# Altium schematic sheet ch.SchDoc
size 406 x 241 mm
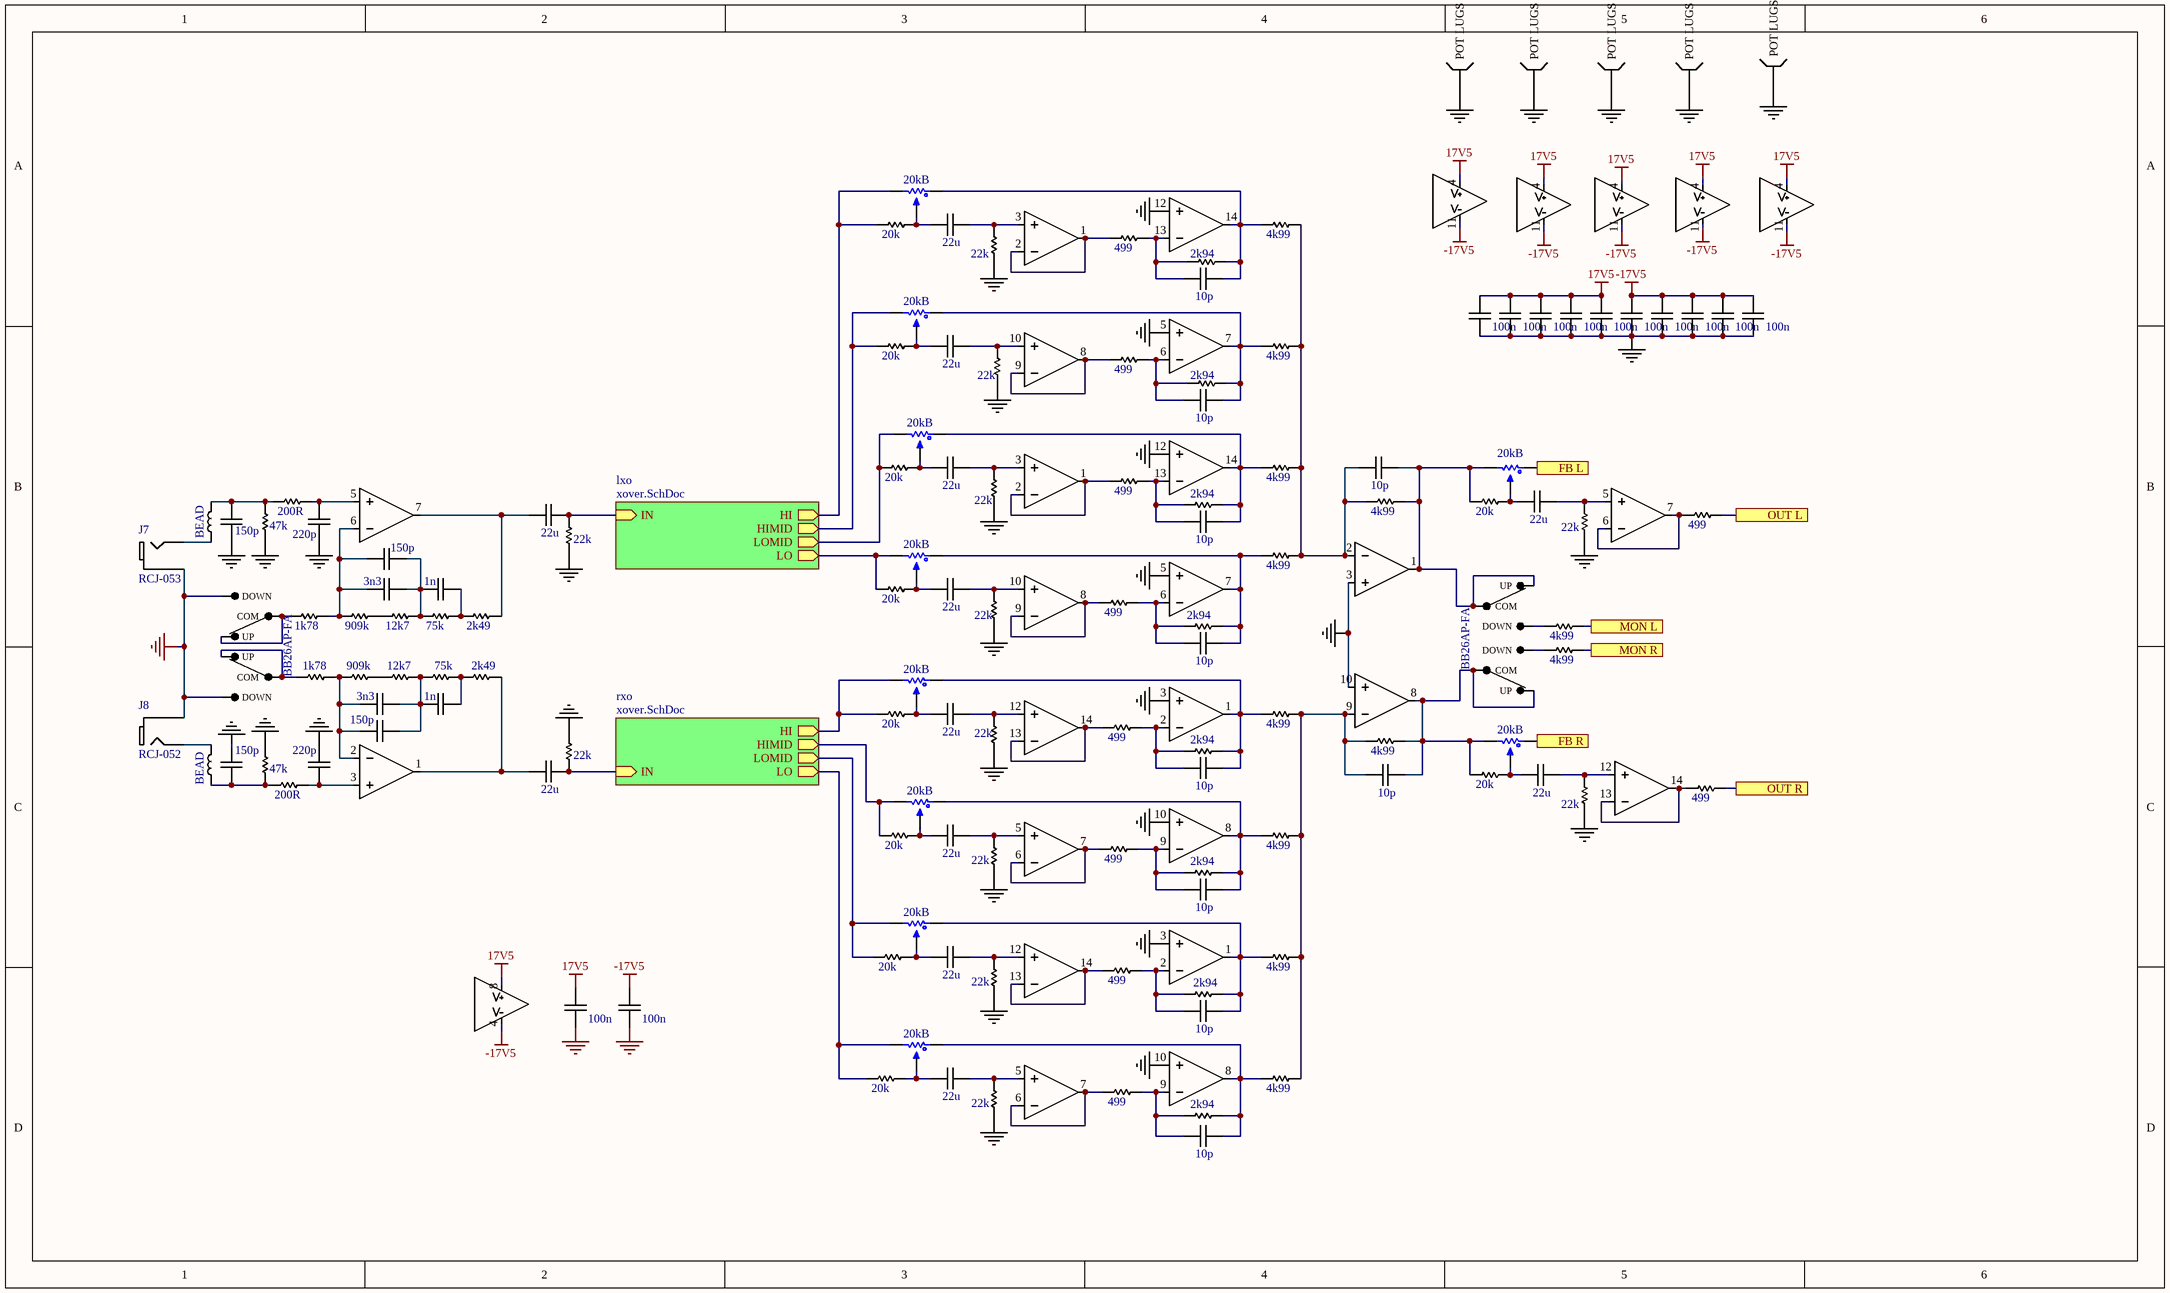
[diagram p0: ch.SchDoc]

## Parts
C1  22u  [0805]
C2  10p  [0805]
C3  100n  [0805]
C4  100n  [0805]
C6  100n  [0805]
C8  100n  [0805]
C9  100n  [0805]
C10  22u  [0805]
C11  10p  [0805]
C12  100n  [0805]
C13  22u  [0805]
C14  22u  [0805]
C16  10p  [0805]
C18  22u  [0805]
C19  10p  [0805]
C20  22u  [0805]
C21  10p  [0805]
C22  22u  [0805]
C25  22u  [0805]
C27  10p  [0805]
C28  10p  [0805]
C29  22u  [0805]
C32  10p  [0805]
C34  22u  [0805]
C35  10p  [0805]
C42  10p  [0805]
C63  220p  [0805]
C64  150p  [0805]
C65  22u  [0805]
C67  150p  [0805]
C68  3n3  [0805]
C69  1n  [0805]
C71  100n  [0805]
C72  100n  [0805]
C74  3n3  [0805]
C75  1n  [0805]
C76  150p  [0805]
C78  150p  [0805]
C79  22u  [0805]
C80  220p  [0805]
C203  100n  [0805]
C208  100n  [0805]
C210  100n  [0805]
C215  100n  [0805]
J7  RCJ-053  [RCJ-053]
J8  RCJ-052  [RCJ-052]
L1  BEAD  [0805]
L2  BEAD  [0805]
R1  20kB  [P0925N-FC15AR10K]  (parts A,B,C of 3)
R2  499  [0805]
R3  22k  [0805]
R4  2k94  [0805]
R8  499  [0805]
R9  22k  [0805]
R10  2k94  [0805]
R11  499  [0805]
R12  22k  [0805]
R14  4k99  [0805]
R15  499  [0805]
R16  20k  [0805]
R17  2k94  [0805]
R18  20k  [0805]
R19  22k  [0805]
R20  4k99  [0805]
R21  4k99  [0805]
R22  499  [0805]
R23  22k  [0805]
R24  2k94  [0805]
R25  20k  [0805]
R28  499  [0805]
R33  22k  [0805]
R34  2k94  [0805]
R35  20k  [0805]
R36  499  [0805]
R37  22k  [0805]
R38  499  [0805]
R39  22k  [0805]
R40  2k94  [0805]
R41  499  [0805]
R42  22k  [0805]
R43  2k94  [0805]
R44  499  [0805]
R45  22k  [0805]
R46  2k94  [0805]
R52  20k  [0805]
R53  200R  [0805]
R54  22k  [0805]
R55  47k  [0805]
R56  20k  [0805]
R57  909k  [0805]
R58  12k7  [0805]
R59  2k49  [0805]
R60  20k  [0805]
R61  20k  [0805]
R62  1k78  [0805]
R63  75k  [0805]
R64  20k  [0805]
R65  20k  [0805]
R66  909k  [0805]
R67  12k7  [0805]
R68  1k78  [0805]
R69  75k  [0805]
R70  2k49  [0805]
R72  47k  [0805]
R73  22k  [0805]
R74  200R  [0805]
R75  4k99  [0805]
R76  4k99  [0805]
R148  20kB  [P0925N-FC15AR10K]  (parts A,B,C of 3)
R149  20kB  [P0925N-FC15AR10K]  (parts A,B,C of 3)
R150  20kB  [P0925N-FC15AR10K]  (parts A,B,C of 3)
R151  20kB  [P0925N-FC15AR10K]  (parts A,B,C of 3)
R173  4k99  [0805]
R177  4k99  [0805]
R184  4k99  [0805]
R187  4k99  [0805]
R200  4k99  [0805]
R201  4k99  [0805]
R207  4k99  [0805]
SW1  BB26AP-FA  [BB26AP-FA]  (parts A,B of 2)
SW5  BB26AP-FA  [BB26AP-FA]  (value not drawn)  (parts A,B of 2)
U1  OPA16X4  [SOIC127P600X175-14M]  (value not drawn)  (parts A,B,C,D,E of 5)
U2  OPA16X4  [SOIC127P600X175-14M]  (value not drawn)  (parts A,B,C,D,E of 5)
U3  OPA16X4  [SOIC127P600X175-14M]  (value not drawn)  (parts A,B,C,D,E of 5)
U4  OPA16X4  [SOIC127P600X175-14M]  (value not drawn)  (parts A,B,C,D,E of 5)
U5  OPA16X4  [SOIC127P600X175-14M]  (value not drawn)  (parts A,B,C,D,E of 5)
U20  OPA16X2  [SOIC127P600X175-8M]  (value not drawn)  (parts A,B,C of 3)

## Sub-sheets
lxo = xover.SchDoc: IN (in), HI (out), HIMID (out), LOMID (out), LO (out)
rxo = xover.SchDoc: IN (in), HI (out), HIMID (out), LOMID (out), LO (out)

## Ports
FB L, FB R, MON L, MON R, OUT L, OUT R

## Nets
17V5: C3.1 C4.1 C9.1 C71.1 C203.1 C208.1 U1.4(V+) U2.4(V+) U3.4(V+) U4.4(V+) U5.4(V+) U20.8(V+)
-17V5: C6.1 C8.1 C12.1 C72.1 C210.1 C215.1 U1.11(V-) U2.11(V-) U3.11(V-) U4.11(V-) U5.11(V-) U20.4(V-)
GND: C3.2 C4.2 C6.2 C8.2 C9.2 C12.2 C63.1 C64.1 C71.2 C72.2 C78.2 C80.2 C203.2 C208.2 C210.2 C215.2 J7.1 J8.1 R1.7(POT_LUGS) R3.1 R9.1 R12.1 R19.1 R23.1 R33.1 R37.1 R39.1 R42.1 R45.1 R54.2 R55.1 R72.2 R73.1 R148.7(POT_LUGS) R149.7(POT_LUGS) R150.7(POT_LUGS) R151.7(POT_LUGS) SW5.1(DOWN) SW5.4(DOWN) U1.5(IN_B+) U1.12(IN_D+) U2.5(IN_B+) U2.12(IN_D+) U3.3(+IN_A) U3.10(IN_C+) U4.3(+IN_A) U4.10(IN_C+) U5.3(+IN_A) U5.10(IN_C+)
FB L: R1.1 ; port FB L
FB R: R1.4 ; port FB R
MON L: R75.2 ; port MON L
MON R: R76.2 ; port MON R
OUT L: R15.2 ; port OUT L
OUT R: R36.2 ; port OUT R
NetC1_1: C1.1 R16.1 R148.2
NetC1_2: C1.2 R3.2 U1.3(+IN_A)
NetC2_1: C2.1 R2.2 R4.1 U1.13(IN_D-)
NetC2_2: C2.2 R4.2 R148.1 R173.1 U1.14(OUT_D)
NetC10_1: C10.1 R18.1 R149.2
NetC10_2: C10.2 R9.2 U1.10(IN_C+)
NetC11_1: C11.1 R8.2 R10.1 U1.6(IN_B-)
NetC11_2: C11.2 R10.2 R149.1 R184.1 U1.7(OUT_B)
NetC13_1: C13.1 R25.1 R150.2
NetC13_2: C13.2 R12.2 U2.3(+IN_A)
NetC14_1: C14.1 R1.2 R35.1
NetC14_2: C14.2 R19.2 U5.5(IN_B+)
NetC16_1: C16.1 R11.2 R17.1 U2.13(IN_D-)
NetC16_2: C16.2 R17.2 R150.1 R200.1 U2.14(OUT_D)
NetC18_1: C18.1 R52.1 R151.2
NetC18_2: C18.2 R23.2 U2.10(IN_C+)
NetC19_1: C19.1 R22.2 R24.1 U2.6(IN_B-)
NetC19_2: C19.2 R20.1 R24.2 R151.1 U2.7(OUT_B)
NetC20_1: C20.1 R56.1 R148.5
NetC20_2: C20.2 R33.2 U3.12(IN_D+)
NetC21_1: C21.1 R28.2 R34.1 U3.2(-IN_A)
NetC21_2: C21.2 R34.2 R148.4 R177.1 U3.1(OUT_A)
NetC22_1: C22.1 R1.5 R60.1
NetC22_2: C22.2 R37.2 U5.12(IN_D+)
NetC25_1: C25.1 R61.1 R149.5
NetC25_2: C25.2 R39.2 U3.5(IN_B+)
NetC27_1: C27.1 R38.2 R40.1 U3.9(IN_C-)
NetC27_2: C27.2 R40.2 R149.4 R187.1 U3.8(OUT_C)
NetC28_1: C28.1 R14.1 R20.2 R173.2 R184.2 R200.2 U5.2(-IN_A)
NetC28_2: C28.2 R1.3 R14.2 R35.2 SW1.2(COM) SW1.3(UP) U5.1(OUT_A)
NetC29_1: C29.1 R64.1 R150.5
NetC29_2: C29.2 R42.2 U4.12(IN_D+)
NetC32_1: C32.1 R41.2 R43.1 U4.2(-IN_A)
NetC32_2: C32.2 R43.2 R150.4 R201.1 U4.1(OUT_A)
NetC34_1: C34.1 R65.1 R151.5
NetC34_2: C34.2 R45.2 U4.5(IN_B+)
NetC35_1: C35.1 R44.2 R46.1 U4.9(IN_C-)
NetC35_2: C35.2 R46.2 R151.4 R207.1 U4.8(OUT_C)
NetC42_1: C42.1 R21.1 R177.2 R187.2 R201.2 R207.2 U5.9(IN_C-)
NetC42_2: C42.2 R1.6 R21.2 R60.2 SW1.5(COM) SW1.6(UP) U5.8(OUT_C)
NetC63_2: C63.2 R53.2 U20.5(IN_B+)
NetC64_2: C64.2 L1.2 R53.1 R55.2
NetC65_1: C65.1 R59.1 U20.7(OUT_B)
NetC65_2: C65.2 R54.1 ; sheet lxo/IN
NetC67_1: C67.1 C68.1 C69.2 R58.2 R63.2
NetC67_2: C67.2 C68.2 R57.1 R62.2 U20.6(IN_B-)
NetC69_1: C69.1 R59.2 R63.1
NetC74_1: C74.1 C76.2 R66.1 R68.1 U20.2(-IN_A)
NetC74_2: C74.2 C75.1 C76.1 R67.2 R69.1
NetC75_2: C75.2 R69.2 R70.1
NetC78_1: C78.1 L2.1 R72.1 R74.1
NetC79_1: C79.1 R70.2 U20.1(OUT_A)
NetC79_2: C79.2 R73.2 ; sheet rxo/IN
NetC80_1: C80.1 R74.2 U20.3(+IN_A)
NetJ7_2: J7.2 L1.1
NetJ8_2: J8.2 L2.2
NetR2_1: R2.1 U1.1(OUT_A) U1.2(-IN_A)
NetR8_1: R8.1 U1.8(OUT_C) U1.9(IN_C-)
NetR11_1: R11.1 U2.1(OUT_A) U2.2(-IN_A)
NetR15_1: R15.1 U5.6(IN_B-) U5.7(OUT_B)
NetR16_2: R16.2 R148.3 ; sheet lxo/HI
NetR18_2: R18.2 R149.3 ; sheet lxo/HIMID
NetR22_1: R22.1 U2.8(OUT_C) U2.9(IN_C-)
NetR25_2: R25.2 R150.3 ; sheet lxo/LOMID
NetR28_1: R28.1 U3.13(IN_D-) U3.14(OUT_D)
NetR36_1: R36.1 U5.13(IN_D-) U5.14(OUT_D)
NetR38_1: R38.1 U3.6(IN_B-) U3.7(OUT_B)
NetR41_1: R41.1 U4.13(IN_D-) U4.14(OUT_D)
NetR44_1: R44.1 U4.6(IN_B-) U4.7(OUT_B)
NetR52_2: R52.2 R151.3 ; sheet lxo/LO
NetR56_2: R56.2 R148.6 ; sheet rxo/HI
NetR57_2: R57.2 R58.1
NetR61_2: R61.2 R149.6 ; sheet rxo/HIMID
NetR62_1: R62.1 SW5.2(COM) SW5.3(UP)
NetR64_2: R64.2 R150.6 ; sheet rxo/LOMID
NetR65_2: R65.2 R151.6 ; sheet rxo/LO
NetR66_2: R66.2 R67.1
NetR68_2: R68.2 SW5.5(COM) SW5.6(UP)
NetR75_1: R75.1 SW1.1(DOWN)
NetR76_1: R76.1 SW1.4(DOWN)

## Library data of the parts
C1 C10 C13 C14 C18 C20 C22 C25 C29 C34 C65 C79 = CAP: PartNumber: GRT21BR61E226ME13L; Supplier 1: Arrow; Supplier Part Number 1: GRT21BR61E226ME13L
C2 C11 C16 C19 C21 C27 C28 C32 C35 C42 = CAP: PartNumber: CC0805JRNPO9BN100; Supplier 1: Arrow; Supplier Part Number 1: CC0805JRNPO9BN100
C3 C4 C6 C8 C9 C12 C71 C72 C203 C208 C210 C215 = CAP: PartNumber: C0805C104K1RAC7800; Supplier 1: Arrow; Supplier Part Number 1: C0805C104K1RAC7800
C63 C80 = CAP: PartNumber: C0805C221J1GACTU; Supplier 1: Arrow; Supplier Part Number 1: C0805C221J1GACTU
C64 C67 C76 C78 = CAP: PartNumber: 08055A151FAT2A; Supplier 1: Arrow; Supplier Part Number 1: 08055A151FAT2A
C68 C74 = CAP: PartNumber: GRM2165C1H332FA01D; Supplier 1: Arrow; Supplier Part Number 1: GRM2165C1H332FA01D
C69 C75 = CAP: PartNumber: GRM2165C1H102FA01J; Supplier 1: Arrow; Supplier Part Number 1: GRM2165C1H102FA01J
L1 L2 = BLM21PG121SH1D: Supplier 1: Arrow; Supplier Part Number 1: BLM21PG121SH1D; PartNumber: BLM21PG121SH1D
R1 R148-R151 = P0925N-FC15BR20K: Supplier 1: Arrow; Supplier Part Number 1: P0925N-FC15BR20K; PartNumber: P0925N-FC15BR20K
R2 R8 R11 R15 R22 R28 R36 R38 R41 R44 = RES: PartNumber: ERJ-6ENF4990V; Supplier 1: Arrow; Supplier Part Number 1: ERJ-6ENF4990V
R3 R9 R12 R19 R23 R33 R37 R39 R42 R45 R54 R73 = RES: PartNumber: ERJ-6ENF2202V; Supplier 1: Arrow; Supplier Part Number 1: ERJ-6ENF2202V
R4 R10 R17 R24 R34 R40 R43 R46 = RES: PartNumber: ERJ-6ENF2941V; Supplier 1: Arrow; Supplier Part Number 1: ERJ-6ENF2941V
R14 R20 R21 R75 R76 R173 R177 R184 R187 R200 R201 R207 = RES: PartNumber: ERJ-6ENF4991V; Supplier 1: Arrow; Supplier Part Number 1: ERJ-6ENF4991V
R16 R18 R25 R35 R52 R56 R60 R61 R64 R65 = RES: PartNumber: ERJ-6ENF2002V; Supplier 1: Arrow; Supplier Part Number 1: ERJ-6ENF2002V
R53 R74 = RES: PartNumber: ERJ-6ENF2000V; Supplier 1: Arrow; Supplier Part Number 1: ERJ-6ENF2000V
R55 R72 = RES: PartNumber: ERJ-6ENF4702V; Supplier 1: Arrow; Supplier Part Number 1: ERJ-6ENF4702V
R57 R66 = RES: PartNumber: ERJ-PB6B9093V; Supplier 1: Arrow; Supplier Part Number 1: ERJ-PB6B9093V
R58 R67 = RES: PartNumber: ERJ-PB6B1272V; Supplier 1: Arrow; Supplier Part Number 1: ERJ-PB6B1272V
R59 R70 = RES: PartNumber: ERA6AEB2491V; Supplier 1: Arrow; Supplier Part Number 1: ERA6AEB2491V
R62 R68 = RES: PartNumber: ERJ-PB6B1781V; Supplier 1: Arrow; Supplier Part Number 1: ERJ-PB6B1781V
R63 R69 = RES: PartNumber: ERA6AEB753V; Supplier 1: Arrow; Supplier Part Number 1: ERA6AEB753V
U1-U5 = OPA16X4: PartNumber: OPA1664AIDR; Supplier 1: Arrow; Supplier Part Number 1: OPA1664AIDR
U20 = OPA16X2: PartNumber: OPA1662AIDRQ1; Supplier 1: Arrow; Supplier Part Number 1: OPA1662AIDRQ1
J7 = RCJ-053: Supplier 1: Arrow; Supplier Part Number 1: RCJ-053; PartNumber: RCJ-053
J8 = RCJ-052: Supplier 1: Arrow; Supplier Part Number 1: RCJ-052; PartNumber: RCJ-052